# EAGLE schematic Front Node_MiniLock (EAGLE 8.1.0)
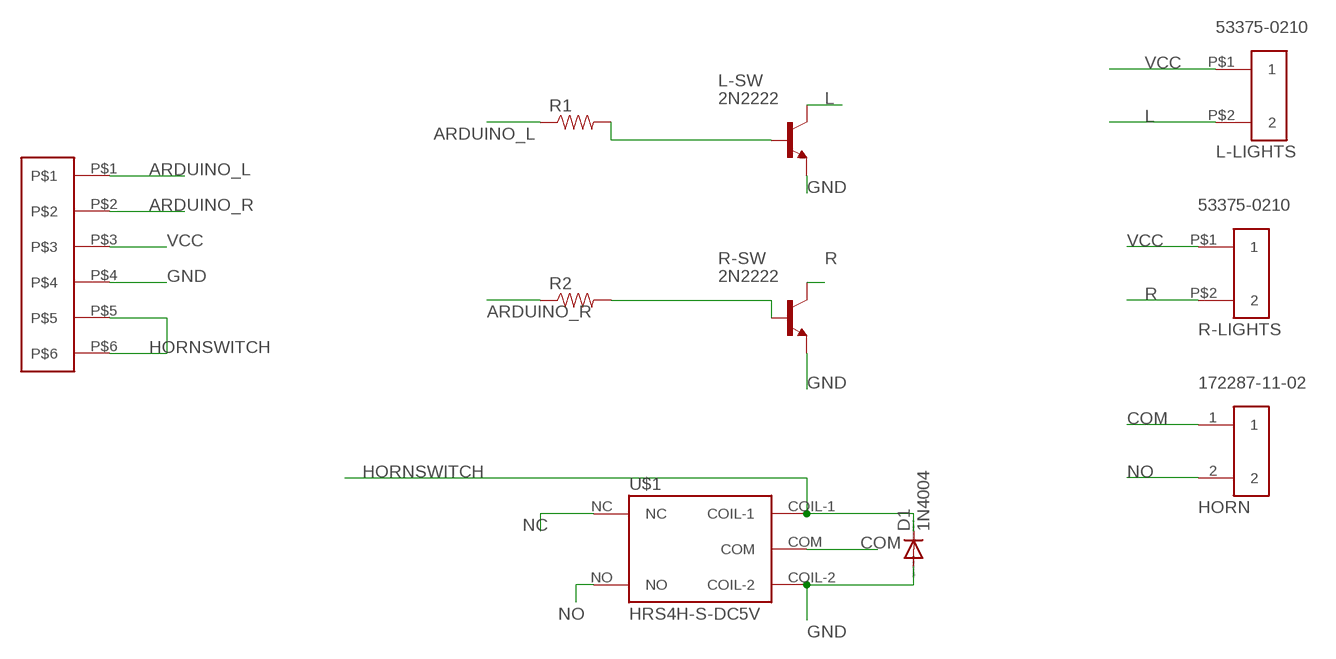
[diagram p0: schematic, sheet 1]

## Parts
ARDUINO  53375-0610  [53375-0610-MINI-LOCK]
D1  1N4004  [DO41-10]
HORN  172287-11-02  [172287-ULTRA-FIT]
L-LIGHTS  53375-0210  [53375-0210-MINI-LOCK]
L-SW  2N2222  [TO18]
R1  RESISTORPTH-1/4W  [AXIAL-0.4]
R2  RESISTORPTH-1/4W  [AXIAL-0.4]
R-LIGHTS  53375-0210  [53375-0210-MINI-LOCK]
R-SW  2N2222  [TO18]
U$1  HRS4H-S-DC5V  [RELAY]

## Nets
ARDUINO_L: ARDUINO.P$1 R1.P$1
ARDUINO_R: ARDUINO.P$2 R2.P$1
COM: HORN.1 U$1.COM
GND: ARDUINO.P$4 D1.A L-SW.1(E) R-SW.1(E) U$1.COIL-2
HORNSWITCH: ARDUINO.P$5 ARDUINO.P$6 D1.C U$1.COIL-1
L: L-LIGHTS.P$2 L-SW.3(C)
N$5: R2.P$2 R-SW.2(B)
N$8: L-SW.2(B) R1.P$2
NC: U$1.NC
NO: HORN.2 U$1.NO
R: R-LIGHTS.P$2 R-SW.3(C)
VCC: ARDUINO.P$3 L-LIGHTS.P$1 R-LIGHTS.P$1

## Library data of the parts
ARDUINO = Hooman:53375-0610: Mini-Lock Header 6 pin 53375 series
D1 = diode:1N4004: DIODE general purpose rectifier, 1 A
HORN = Hooman:172287-11-02: Ultra-Fit™ 172287 Header Molex 3.5 mm pitch 2 pin connector header
L-LIGHTS R-LIGHTS = Hooman:53375-0210: Mini-Lock Header 2 pin 53375 series
L-SW R-SW = transistor-npn:2N2222*: NPN Transistor
R1 R2 = SparkFun-Passives:RESISTOR: Resistor Basic schematic elements and footprints for 0603, 1206, and PTH resistors.
U$1 = Hooman:HRS4H-S-DC5V